# EAGLE design cascade_sampler_6D (EAGLE 9.2.2)
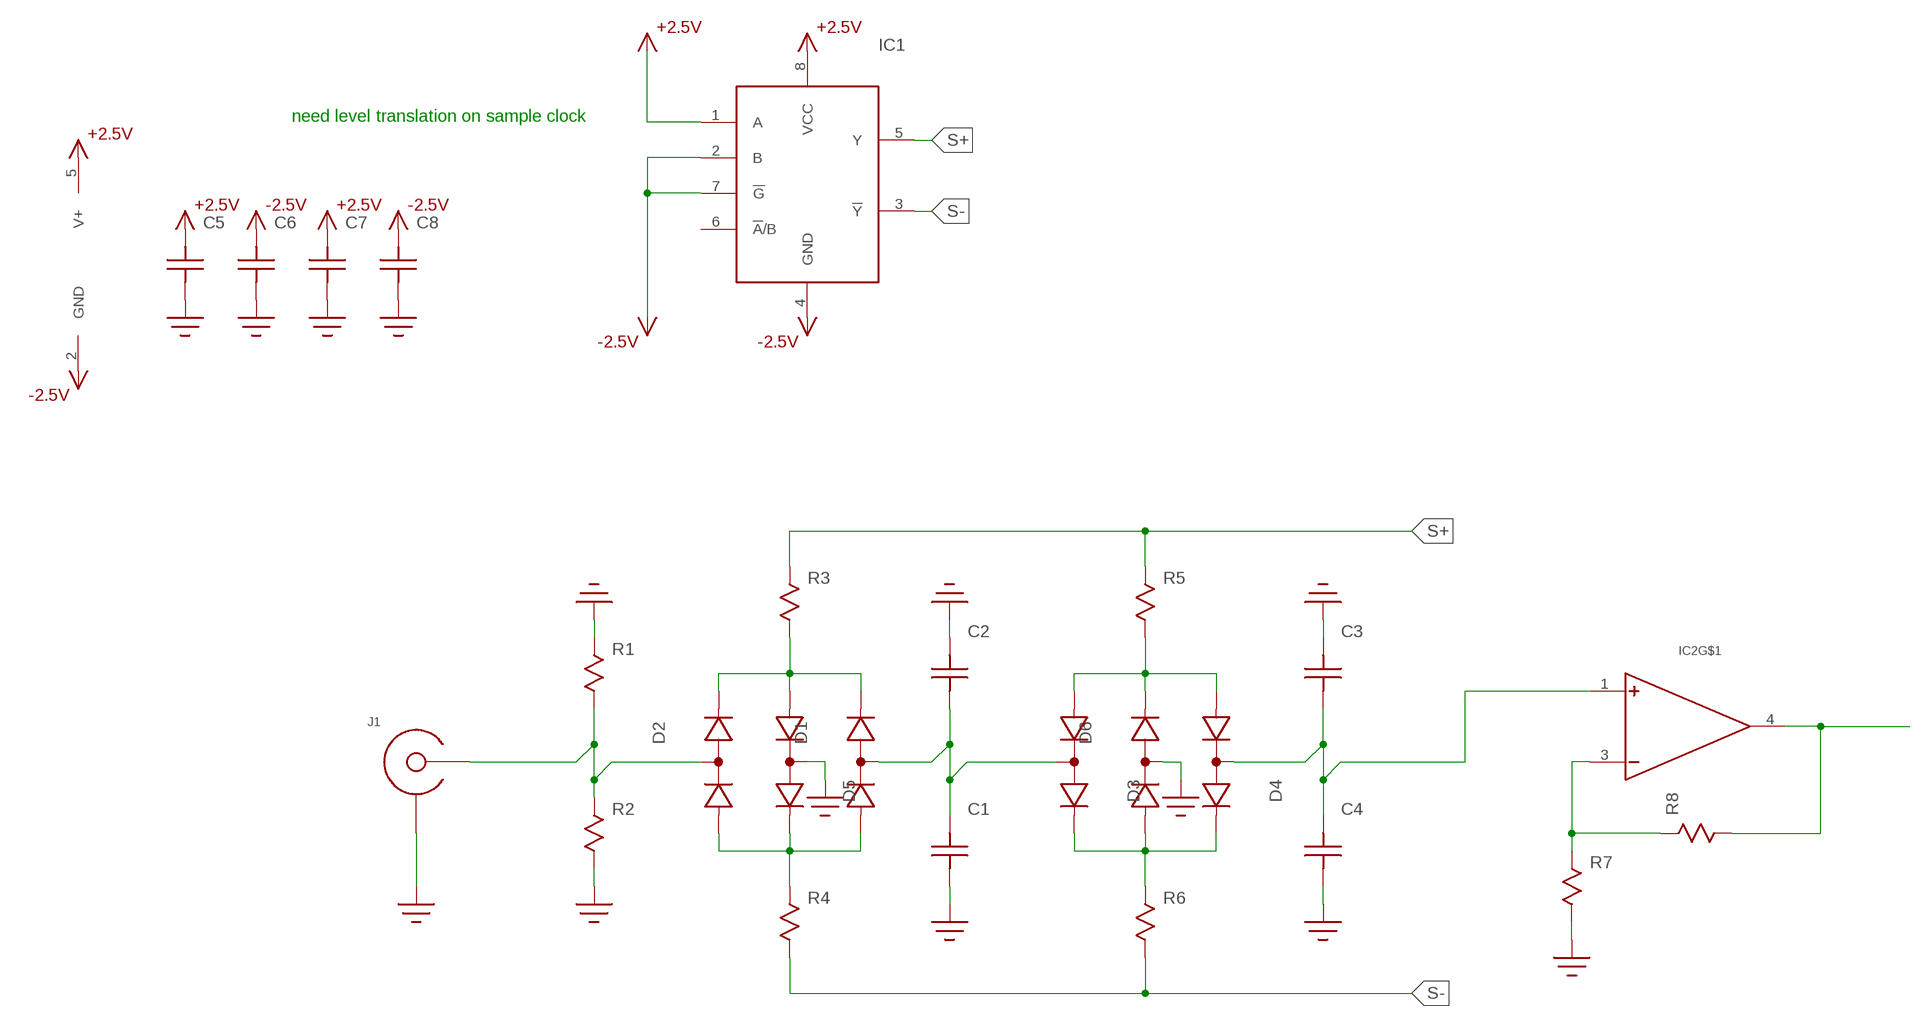
[diagram p0: schematic, sheet 1]

## Parts
C1  C0603  [C0603]
C2  C0603  [C0603]
C3  C0603  [C0603]
C4  C0603  [C0603]
C5  C0603  [C0603]
C6  C0603  [C0603]
C7  C0603  [C0603]
C8  C0603  [C0603]
D1  MMBD352LT1G  [SOT-23]
D2  MMBD353LT1G  [SOT-23]
D3  MMBD352LT1G  [SOT-23]
D4  MMBD353LT1G  [SOT-23]
D5  MMBD353LT1G  [SOT-23]
D6  MMBD352LT1G  [SOT-23]
IC1  74LVC2G157  [SSOP8]
IC2  MCP6V81U  [SOT23-5]
J1  EDGE_LAUNCH_JACKNARROW  [EDGE_LAUNCH_RF_CON_NARROW]
R1  R0603  [R0603]
R2  R0603  [R0603]
R3  R0603  [R0603]
R4  R0603  [R0603]
R5  R0603  [R0603]
R6  R0603  [R0603]
R7  R0603  [R0603]
R8  R0603  [R0603]

## Nets
+2.5V: C5.P$2 C7.P$2 IC1.1(A) IC1.8(VCC) IC2.5(V+)
-2.5V: C6.P$2 C8.P$2 IC1.2(B) IC1.4(GND) IC1.7(!G!) IC2.2(GND)
GND: C1.P$1 C2.P$2 C3.P$2 C4.P$1 C5.P$1 C6.P$1 C7.P$1 C8.P$1 D5.3(COMMON) D6.3(COMMON) J1.GND@1(SHIELD) J1.GND@2(SHIELD) J1.GND@3(SHIELD) J1.GND@4(SHIELD) J1.GND@5(SHIELD) J1.GND@6(SHIELD) J1.SHIELD@1(SHIELD) J1.SHIELD@2(SHIELD) R1.P$1 R2.P$2 R7.P$2
N$1: D2.3(COMMON) J1.CENTER R1.P$2 R2.P$1
N$2: C1.P$2 C2.P$1 D1.3(COMMON) D3.3(COMMON)
N$3: D1.2(CATHODE) D2.1(CATHODE) D5.2(ANODE) R3.P$2
N$4: D1.1(ANODE) D2.2(ANODE) D5.1(CATHODE) R4.P$1
N$5: C3.P$1 C4.P$2 D4.3(COMMON) IC2.1(+)
N$6: D3.1(ANODE) D4.2(ANODE) D6.2(CATHODE) R5.P$2
N$7: D3.2(CATHODE) D4.1(CATHODE) D6.1(ANODE) R6.P$1
N$8: IC2.3(-) R7.P$1 R8.P$1
N$9: IC2.4(OUT) R8.P$2
S+: IC1.5(Y) R3.P$1 R5.P$1
S-: IC1.3(!Y!) R4.P$2 R6.P$2
Unconnected: IC1.6(!A!/B)

## Notes on the sheet
- need level translation on sample clock

## Library data of the parts
C1-C8 = yapo:C
D1 D3 D6 = yapo:MMBD352LT1G
D2 D4 D5 = yapo:MMBD353LT1G
IC1 = yapo:74LVC2G157
IC2 = yapo:MCP6V81U
J1 = yapo:EDGE_LAUNCH_JACK
R1-R8 = yapo:R

## Board
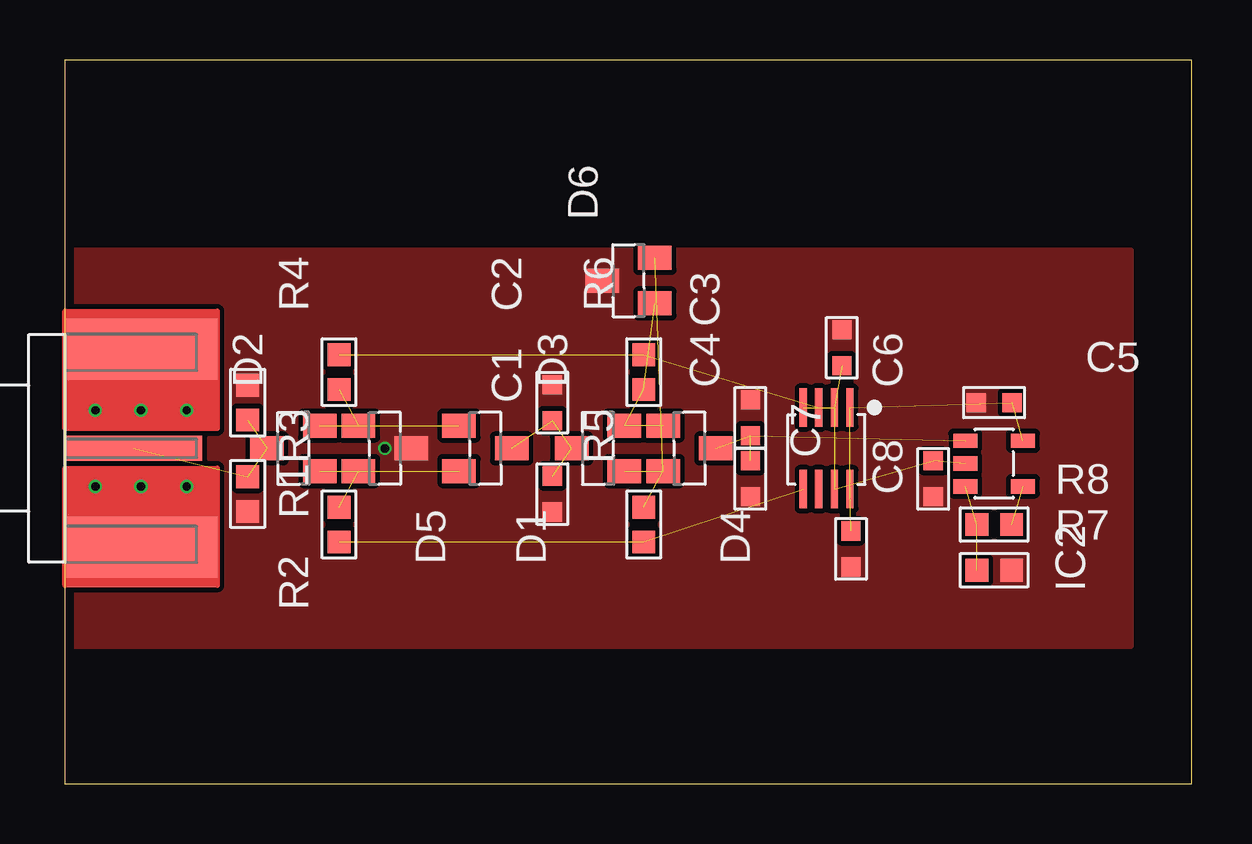
[diagram p1: board, top side]
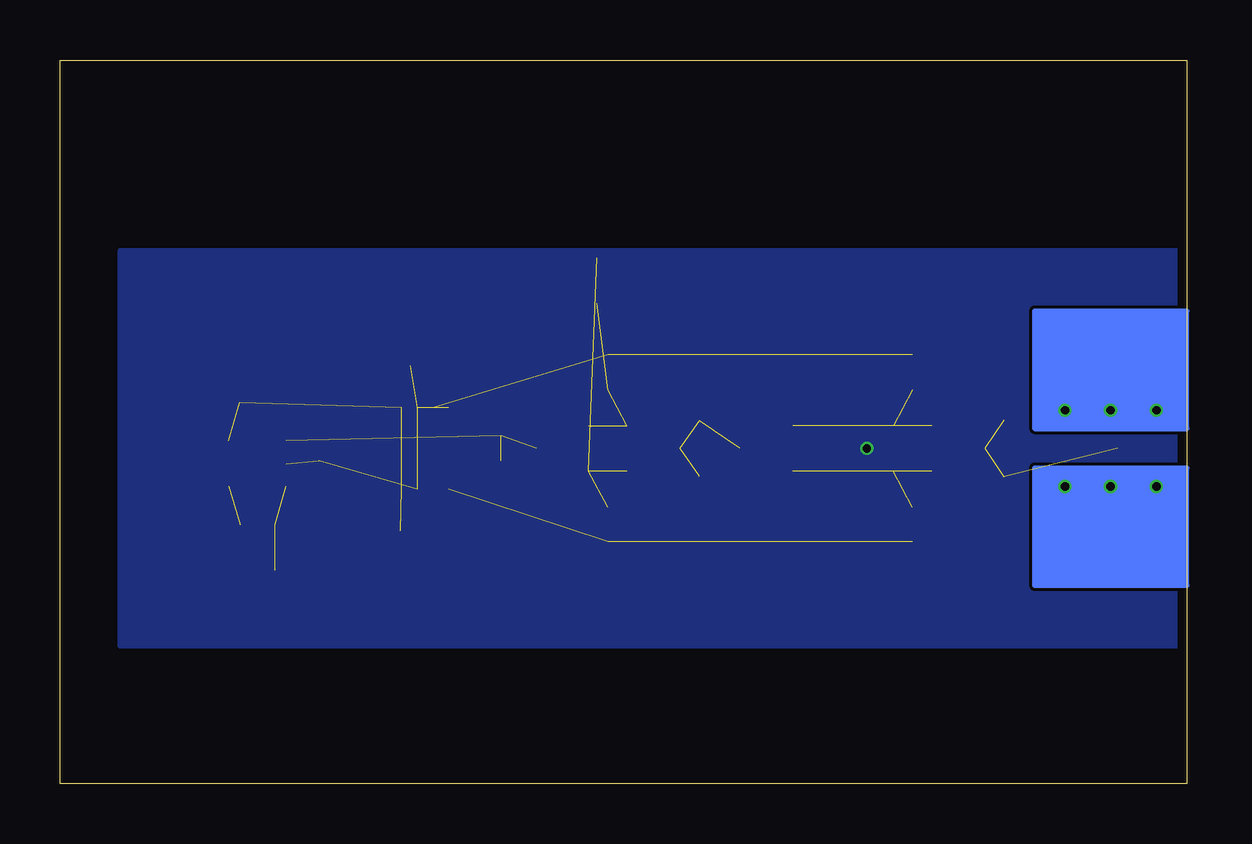
[diagram p2: board, bottom side, seen from below]

Size 46.97 x 30.15 mm. Coordinates in mm from the lower left corner, seen from the top.
Outline: 0,0 46.97,0 46.97,30.15 0,30.15 0,0
Copper layers (1*2*15*16): Top 0.035559375mm / dielectric 0.17018125mm / Route2 0.01778125mm / dielectric 47mil / Route15 0.01778125mm / dielectric 0.17018125mm / Bottom 0.035559375mm
Design rules "oshpark-4layer": minimum track width 5mil, minimum drill 10mil, track to track 5mil, track to pad 5mil, pad to pad 5mil, via to via 5mil, smd to smd 5mil, copper to edge 15mil, drill to drill 6mil, minimum pad ring 4mil, minimum via ring 4mil, stop-mask expansion 2.5mil, vias tented up to drill 0mil, thermal gap 10mil

### Footprints (pad centres in the part's own frame; a part is rotated, then mirrored left to right if it is on the bottom)
C0603 = smd 0.8 x 0.8: P$1 -0.75,0; P$2 0.75,0
SOT-23 = smd 1 x 1.4: 1 -0.95,-1.1; 2 0.95,-1.1; 3 0,1.1
SSOP8 = smd 0.3 x 1.6: 1 -0.975,-1.7; 2 -0.325,-1.7; 3 0.325,-1.7; 4 0.975,-1.7; 5 0.975,1.7; 6 0.325,1.7; 7 -0.325,1.7; 8 -0.975,1.7
SOT23-5 = smd 0.6 x 1: 1 -0.95,-1.2; 2 0,-1.2; 3 0.95,-1.2; 4 0.95,1.2; 5 -0.95,1.2
EDGE_LAUNCH_RF_CON_NARROW = smd 5.715 x 1.041: CENTER -2.875,0 | drill 0.35: GND@1 -5.08,1.587; GND@2 -3.175,1.587; GND@3 -1.27,1.587; GND@4 -5.08,-1.587; GND@5 -3.175,-1.587; GND@6 -1.27,-1.587 | smd 6.35 x 2.54: SHIELD@1 -3.175,-4.128; SHIELD@2 -3.175,4.128
R0603 = smd 0.95 x 0.95: P$1 -0.725,0; P$2 0.725,0

### Placement (x,y rotation side)
C1  20.32,12.06 90 top
C2  20.32,15.88 90 top
C3  28.57,15.24 90 top
C4  28.57,12.7 90 top
C5  38.73,15.88 0 top
C6  36.2,12.7 90 top
C7  32.77,9.78 90 top
C8  32.38,18.16 270 top
D1  17.53,13.97 270 top
D2  9.53,13.97 90 top
D3  22.23,13.97 90 top
D4  26.04,13.97 270 top
D5  13.34,13.97 270 top
D6  23.5,20.95 90 top
IC1  31.75,13.97 180 top
IC2  38.73,13.34 270 top
J1  0,13.97 180 top
R1  7.62,15.88 270 top
R2  7.62,12.06 270 top
R3  11.43,10.79 90 top
R4  11.43,17.14 90 top
R5  24.13,10.79 90 top
R6  24.13,17.14 90 top
R7  38.73,8.89 0 top
R8  38.73,10.79 0 top

### Tracks (layer width: path | path; a pad name or v marks a point on that pad's centre or on a via)
+2.5V  (4 unrouted)
-2.5V  (5 unrouted)
GND  (via drill 0.35)
  other vias: 13.34,13.97
  pour Top (isolate 0.203, no thermals): 0,5.71 44.45,5.71 44.45,22.23 0,22.23
  pour Bottom: 0,5.71 44.45,5.71 44.45,22.23 0,22.23
N$1  (3 unrouted)
N$2  (3 unrouted)
N$3  (3 unrouted)
N$4  (3 unrouted)
N$5  (3 unrouted)
N$6  (3 unrouted)
N$7  (3 unrouted)
N$8  (2 unrouted)
N$9  (1 unrouted)
S+  (2 unrouted)
S-  (2 unrouted)